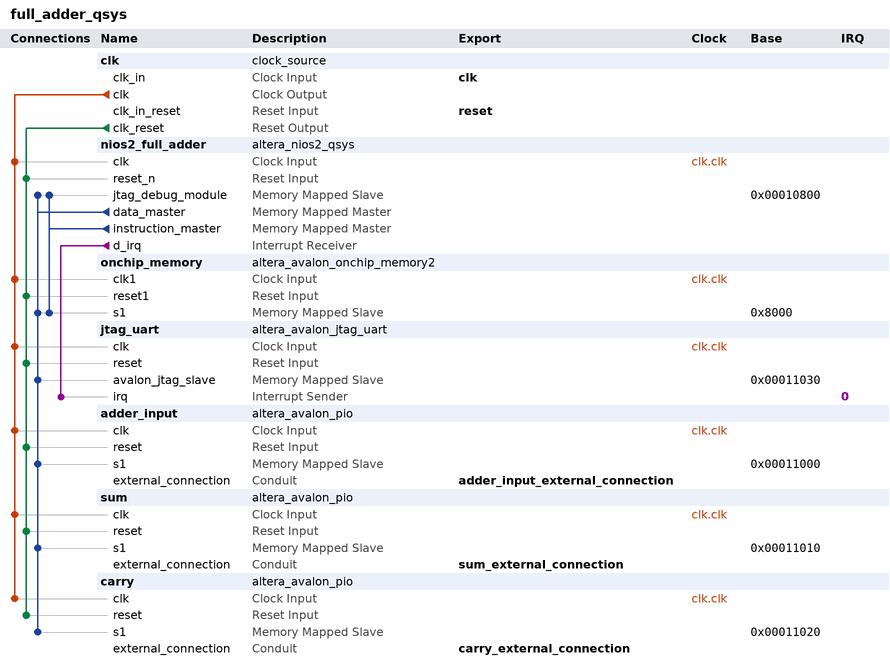
[diagram p0: system contents]
# Platform Designer (Qsys) system full_adder_qsys
# Parameters at their usual value, and those the tool derives, are not listed.
package require -exact qsys 11.1
create_system full_adder_qsys
set_project_property DEVICE_FAMILY CYCLONEIII

add_instance clk clock_source 11.1
set_instance_parameter_value clk clockFrequency 50000000

add_instance nios2_full_adder altera_nios2_qsys 11.1
set_instance_parameter_value nios2_full_adder resetSlave onchip_memory.s1
set_instance_parameter_value nios2_full_adder exceptionSlave onchip_memory.s1
set_instance_parameter_value nios2_full_adder breakSlave nios2_full_adder.jtag_debug_module
set_instance_parameter_value nios2_full_adder impl Tiny
set_instance_parameter_value nios2_full_adder icache_size 4096

add_instance onchip_memory altera_avalon_onchip_memory2 11.1
set_instance_parameter_value onchip_memory dataWidth 32
set_instance_parameter_value onchip_memory dualPort false
set_instance_parameter_value onchip_memory initMemContent true
set_instance_parameter_value onchip_memory initializationFileName onchip_memory
set_instance_parameter_value onchip_memory memorySize 20480

add_instance jtag_uart altera_avalon_jtag_uart 11.1
set_instance_parameter_value jtag_uart simInteractiveOptions INTERACTIVE_ASCII_OUTPUT

add_instance adder_input altera_avalon_pio 11.1
set_instance_parameter_value adder_input direction Output
set_instance_parameter_value adder_input width 3

add_instance sum altera_avalon_pio 11.1
set_instance_parameter_value sum direction Input
set_instance_parameter_value sum width 1

add_instance carry altera_avalon_pio 11.1
set_instance_parameter_value carry direction Input
set_instance_parameter_value carry width 1

# connections
add_connection clk.clk adder_input.clk clock
add_connection clk.clk carry.clk clock
add_connection clk.clk jtag_uart.clk clock
add_connection clk.clk nios2_full_adder.clk clock
add_connection clk.clk onchip_memory.clk1 clock
add_connection clk.clk sum.clk clock
add_connection clk.clk_reset adder_input.reset reset
add_connection clk.clk_reset carry.reset reset
add_connection clk.clk_reset jtag_uart.reset reset
add_connection clk.clk_reset nios2_full_adder.reset_n reset
add_connection clk.clk_reset onchip_memory.reset1 reset
add_connection clk.clk_reset sum.reset reset
add_connection nios2_full_adder.data_master adder_input.s1 avalon
set_connection_parameter_value nios2_full_adder.data_master/adder_input.s1 baseAddress 0x00011000
add_connection nios2_full_adder.data_master carry.s1 avalon
set_connection_parameter_value nios2_full_adder.data_master/carry.s1 baseAddress 0x00011020
add_connection nios2_full_adder.data_master jtag_uart.avalon_jtag_slave avalon
set_connection_parameter_value nios2_full_adder.data_master/jtag_uart.avalon_jtag_slave baseAddress 0x00011030
add_connection nios2_full_adder.data_master nios2_full_adder.jtag_debug_module avalon
set_connection_parameter_value nios2_full_adder.data_master/nios2_full_adder.jtag_debug_module baseAddress 0x00010800
add_connection nios2_full_adder.data_master onchip_memory.s1 avalon
set_connection_parameter_value nios2_full_adder.data_master/onchip_memory.s1 baseAddress 0x8000
add_connection nios2_full_adder.data_master sum.s1 avalon
set_connection_parameter_value nios2_full_adder.data_master/sum.s1 baseAddress 0x00011010
add_connection nios2_full_adder.instruction_master nios2_full_adder.jtag_debug_module avalon
set_connection_parameter_value nios2_full_adder.instruction_master/nios2_full_adder.jtag_debug_module baseAddress 0x00010800
add_connection nios2_full_adder.instruction_master onchip_memory.s1 avalon
set_connection_parameter_value nios2_full_adder.instruction_master/onchip_memory.s1 baseAddress 0x8000
add_connection nios2_full_adder.d_irq jtag_uart.irq interrupt
set_connection_parameter_value nios2_full_adder.d_irq/jtag_uart.irq irqNumber 0

# exported interfaces
add_interface clk clock sink
set_interface_property clk EXPORT_OF clk.clk_in
add_interface reset reset sink
set_interface_property reset EXPORT_OF clk.clk_in_reset
add_interface adder_input_external_connection conduit end
set_interface_property adder_input_external_connection EXPORT_OF adder_input.external_connection
add_interface sum_external_connection conduit end
set_interface_property sum_external_connection EXPORT_OF sum.external_connection
add_interface carry_external_connection conduit end
set_interface_property carry_external_connection EXPORT_OF carry.external_connection

save_system full_adder_qsys.qsys
